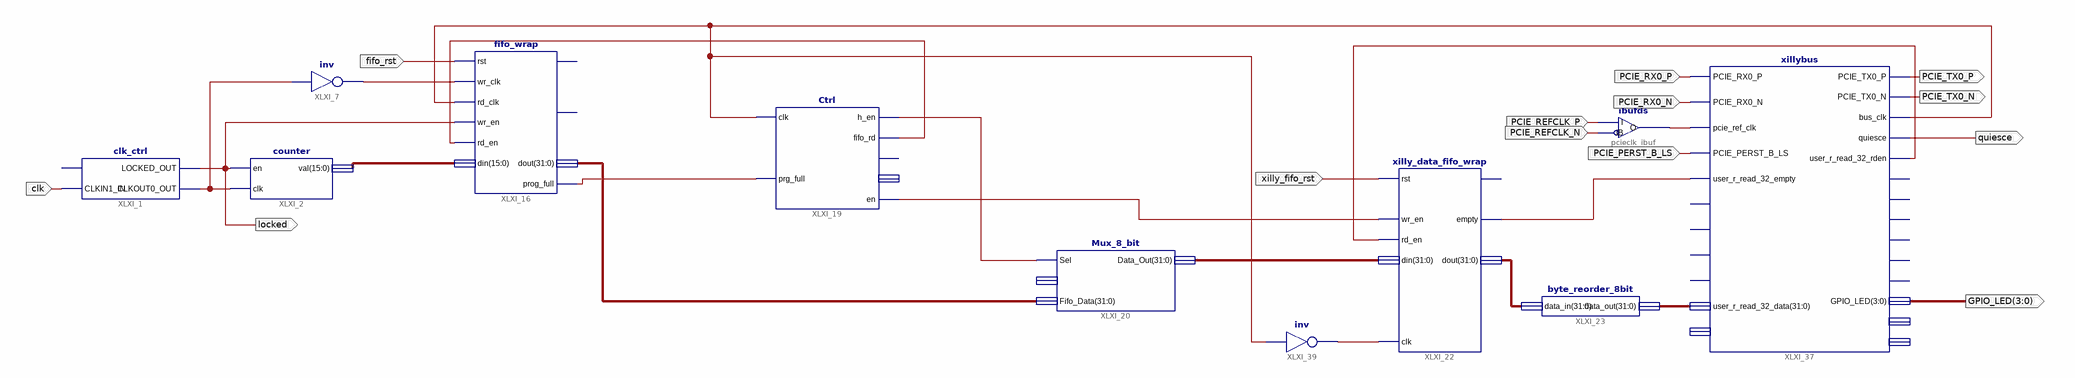
[diagram p0: schematic sheet 1]
// Xilinx ISE schematic xillyctr.sch (virtex5) as structural Verilog: 11 symbols, 13 ports
module xillyctr (
  input  fifo_rst,
  input  clk,
  input  xilly_fifo_rst,
  input  PCIE_REFCLK_P,
  input  PCIE_REFCLK_N,
  input  PCIE_PERST_B_LS,
  input  PCIE_RX0_P,
  input  PCIE_RX0_N,
  output locked,
  output [3:0] GPIO_LED,
  output quiesce,
  output PCIE_TX0_P,
  output PCIE_TX0_N
);

  wire busclk, pcie_ref_clk, samp_clk, XLXN_13, XLXN_18, XLXN_19, XLXN_26, XLXN_96, XLXN_97, XLXN_99,
       XLXN_101;
  wire [15:0] XLXN_3;
  wire [31:0] xf_data, XLXN_29, XLXN_94, XLXN_98;

  clk_ctrl XLXI_1 (.CLKIN1_IN(clk), .LOCKED_OUT(locked), .CLKOUT0_OUT(samp_clk));  // open: RST_IN
  not XLXI_7 (XLXN_13, samp_clk);
  fifo_wrap XLXI_16 (
    .rst(fifo_rst), .wr_clk(XLXN_13), .rd_clk(busclk), .wr_en(locked), .rd_en(XLXN_18), .din(XLXN_3),
    .dout(XLXN_29), .prog_full(XLXN_19));  // open: full, empty
  counter XLXI_2 (.en(locked), .clk(samp_clk), .val(XLXN_3));
  byte_reorder_8bit XLXI_23 (.data_in(XLXN_98), .data_out(xf_data));
  xillybus XLXI_37 (
    .PCIE_RX0_P(PCIE_RX0_P), .PCIE_RX0_N(PCIE_RX0_N), .pcie_ref_clk(pcie_ref_clk),
    .PCIE_PERST_B_LS(PCIE_PERST_B_LS), .user_r_read_32_empty(XLXN_97), .user_r_read_32_data(xf_data),
    .PCIE_TX0_P(PCIE_TX0_P), .PCIE_TX0_N(PCIE_TX0_N), .bus_clk(busclk), .quiesce(quiesce),
    .user_r_read_32_rden(XLXN_99), .GPIO_LED(GPIO_LED));  // open: user_r_read_32_eof, user_r_mem_8_empty, user_r_mem_8_eof, user_w_mem_8_full, user_r_mem_8_data, user_r_read_32_open, user_r_mem_8_rden, user_r_mem_8_open, user_w_mem_8_wren, user_w_mem_8_open, user_mem_8_addr_update, user_w_mem_8_data, user_mem_8_addr
  ibufds pcieclk_ibuf (.I(PCIE_REFCLK_P), .IB(PCIE_REFCLK_N), .O(pcie_ref_clk));
  not XLXI_39 (XLXN_101, busclk);
  xilly_data_fifo_wrap XLXI_22 (
    .rst(xilly_fifo_rst), .wr_en(XLXN_96), .rd_en(XLXN_99), .din(XLXN_94), .empty(XLXN_97), .dout(XLXN_98),
    .clk(XLXN_101));  // open: full
  Mux_8_bit XLXI_20 (.Sel(XLXN_26), .Fifo_Data(XLXN_29), .Data_Out(XLXN_94));  // open: Header_data
  Ctrl XLXI_19 (
    .clk(busclk), .prg_full(XLXN_19), .h_en(XLXN_26), .fifo_rd(XLXN_18), .en(XLXN_96));  // open: fr_cnt, Header_Address
endmodule
